# EAGLE schematic TripleClockGenerator (EAGLE 9.5.2)
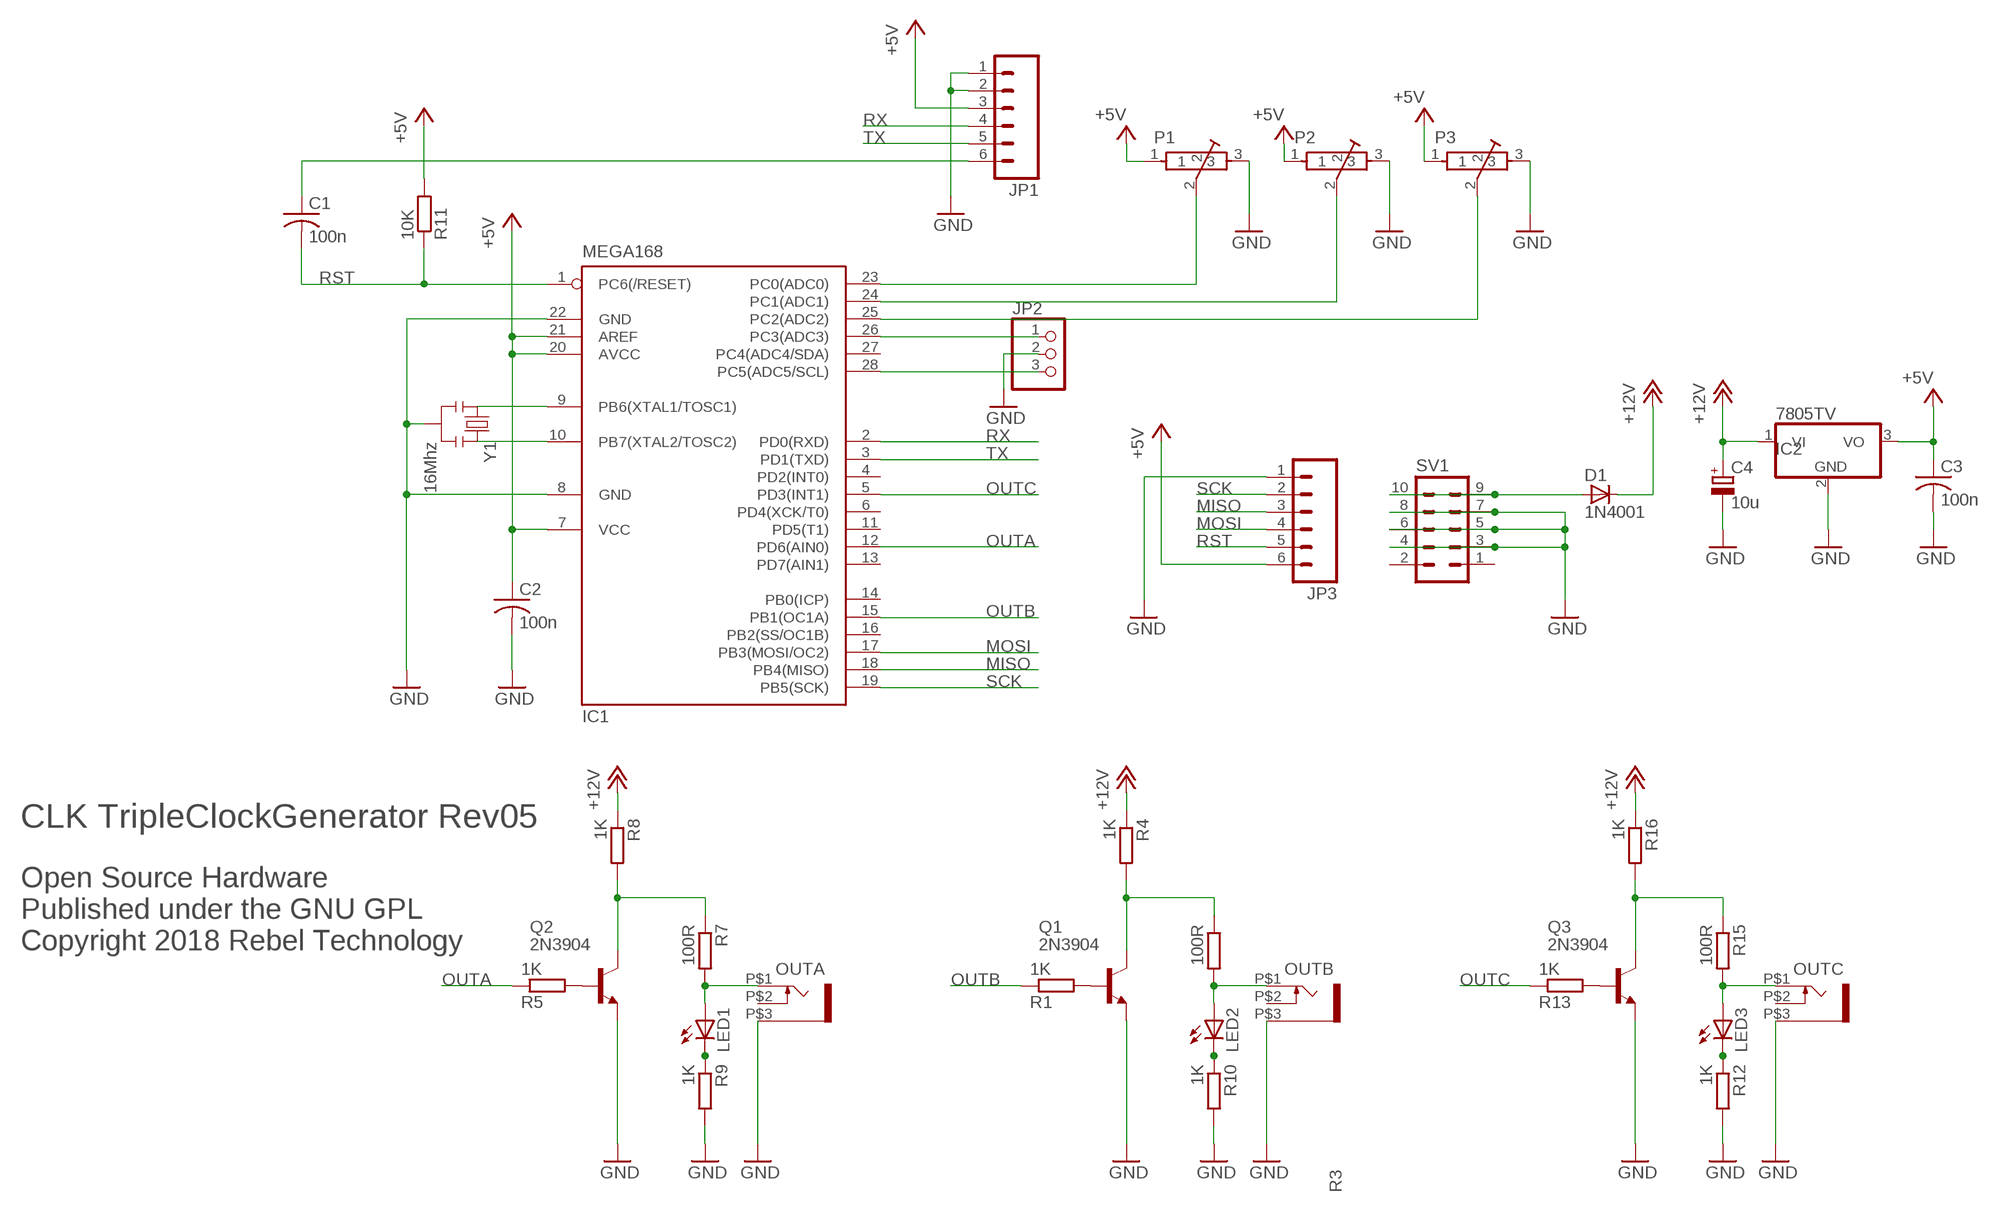
[diagram p0: schematic, sheet 1]

## Parts
C1  100n  C-US050-024X044  [C050-024X044]
C2  100n  C-US050-024X044  [C050-024X044]
C3  100n  C-US050-024X044  [C050-024X044]
C4  10u  CPOL-EUE5-6  [E5-6]
D1  1N4001  DIODE1N4001  [DIODE-1N4001]
IC1  MEGA168  MEGA8-P  [DIL28-3]
IC2  7805TV  [TO220V]
JP1  M06SIP  [1X06]
JP2  PINHD-1X3  [1X03]
JP3  M06SIP  [1X06]
LED1  LED3MM  [LED3MM]
LED2  LED3MM  [LED3MM]
LED3  LED3MM  [LED3MM]
OUTA  JACK-UJ-3502-RSLOT  [UJ-3502-R-SLOT]
OUTB  JACK-UJ-3502-RSLOT  [UJ-3502-R-SLOT]
OUTC  JACK-UJ-3502-RSLOT  [UJ-3502-R-SLOT]
P1  POT-BOURNS-PTD901  [POT-BOURNS-PTD901]
P2  POT-BOURNS-PTD901  [POT-BOURNS-PTD901]
P3  POT-BOURNS-PTD901  [POT-BOURNS-PTD901]
Q1  2N3904  [TO92]
Q2  2N3904  [TO92]
Q3  2N3904  [TO92]
R1  1K  R-EU_0204/7  [0204/7]
R3  100R  R-EU_0204/7  [0204/7]
R4  1K  R-EU_0204/7  [0204/7]
R5  1K  R-EU_0204/7  [0204/7]
R7  100R  R-EU_0204/7  [0204/7]
R8  1K  R-EU_0204/7  [0204/7]
R9  1K  R-EU_0204/7  [0204/7]
R10  1K  R-EU_0204/7  [0204/7]
R11  10K  R-EU_0204/7  [0204/7]
R12  1K  R-EU_0204/7  [0204/7]
R13  1K  R-EU_0204/7  [0204/7]
R15  100R  R-EU_0204/7  [0204/7]
R16  1K  R-EU_0204/7  [0204/7]
SV1  MA05-2  [MA05-2]
Y1  16Mhz  RESONATORPTH  [RESONATOR-PTH]

## Nets
+5V: C2.1 C3.1 IC1.7(VCC) IC1.20(AVCC) IC1.21(AREF) IC2.3(VO) JP1.3 JP3.6 P1.1 P2.1 P3.1 R11.2
+12V: C4.+ D1.C IC2.1(VI) R4.1 R8.1 R16.1
ADC0: IC1.23(PC0(ADC0)) P1.2
ADC1: IC1.24(PC1(ADC1)) P2.2
ADC2: IC1.25(PC2(ADC2)) P3.2
GND: C2.2 C3.2 C4.- IC1.8(GND) IC1.22(GND) IC2.2(GND) JP1.1 JP1.2 JP2.2 JP3.1 OUTA.P$3(SLEEVE) OUTB.P$3(SLEEVE) OUTC.P$3(SLEEVE) P1.3 P2.3 P3.3 Q1.3(E) Q2.3(E) Q3.3(E) R9.2 R10.2 R12.2 SV1.3 SV1.4 SV1.5 SV1.6 SV1.7 SV1.8 Y1.2
MISO: IC1.18(PB4(MISO)) JP3.3
MOSI: IC1.17(PB3(MOSI/OC2)) JP3.4
N$3: LED3.K(C) R12.1
N$7: IC1.9(PB6(XTAL1/TOSC1)) Y1.1
N$8: IC1.10(PB7(XTAL2/TOSC2)) Y1.3
N$11: IC1.28(PC5(ADC5/SCL)) JP2.3
N$13: LED2.A OUTB.P$1(TIP) R3.2
N$14: Q1.1(C) R3.1 R4.2
N$15: IC1.26(PC3(ADC3)) JP2.1
N$21: Q1.2(B) R1.2
N$22: Q3.2(B) R13.2
N$23: LED3.A OUTC.P$1(TIP) R15.2
N$24: Q3.1(C) R15.1 R16.2
N$25: Q2.2(B) R5.2
N$26: LED1.A OUTA.P$1(TIP) R7.2
N$27: Q2.1(C) R7.1 R8.2
N$28: LED1.K(C) R9.1
N$29: C1.1 JP1.6
N$30: LED2.K(C) R10.1
N$45: D1.A SV1.9 SV1.10
OUTA: IC1.12(PD6(AIN0)) R5.1
OUTB: IC1.15(PB1(OC1A)) R1.1
OUTC: IC1.5(PD3(INT1)) R13.1
RST: C1.2 IC1.1(PC6(/RESET)) JP3.5 R11.1
RX: IC1.2(PD0(RXD)) JP1.4
SCK: IC1.19(PB5(SCK)) JP3.2
TX: IC1.3(PD1(TXD)) JP1.5
Unconnected: IC1.4(PD2(INT0)) IC1.6(PD4(XCK/T0)) IC1.11(PD5(T1)) IC1.13(PD7(AIN1)) IC1.14(PB0(ICP)) IC1.16(PB2(SS/OC1B)) IC1.27(PC4(ADC4/SDA)) OUTA.P$2(SW) OUTB.P$2(SW) OUTC.P$2(SW) SV1.1 SV1.2

## Notes on the sheet
- CLK TripleClockGenerator Rev05
- Open Source Hardware
  Published under the GNU GPL
  Copyright 2018 Rebel Technology

## Library data of the parts
C1-C3 = rcl:C-US: CAPACITOR, American symbol
C4 = rcl:CPOL-EU: POLARIZED CAPACITOR, European symbol
D1 = Rebel:DIODE: Diode These are standard reverse protection diodes and small signal diodes. SMA package can handle up to about 1A. SOD-323 can handle about 200mA. Watch the SOD-323 package when ordering, there are some mfgs out there that are 5-pin packages.
IC1 = atmel:MEGA8-P: MICROCONTROLLER 8 Kbytes FLASH, 1 kbytes SRAM, 512 bytes EEPROM, USART, 4-channel 10 bit ADC, 2-channel 8 bit ADC Pin compatible with Atmega48, ATMega88, ATMega168 Source: avr.lbr; OC_FARNELL: unknown; OC_NEWARK: unknown
IC2 = linear:78*: Positive VOLTAGE REGULATOR Source: http://cache.national.com/ds/LM/LM78L05.pdf http://www.fairchildsemi.com/ds/LM/LM7805.pdf
JP1 JP3 = SparkFun:M06: Header 6 Standard 6-pin 0.1" header. Use with straight break away headers (SKU : PRT-00116), right angle break away headers (PRT-00553), swiss pins (PRT-00743), machine pins (PRT-00117), and female headers (PRT-00115). Molex polarized connector foot print use with SKU : PRT-08094 with associated crimp pins and housings. NOTES ON THE VARIANTS LOCK and LOCK_LONGPADS... This footprint was designed to help hold the alignment of a through-hole component (i.e. 6-pin header) while soldering it into place. You may notice that each hole has been shifted either up or down by 0.005 of an inch from it's more standard position (which is a perfectly straight line). This slight alteration caused the pins (the squares in the middle) to touch the edges of the holes. Because they are alternating, it causes a "brace" to hold the component in place. 0.005 has proven to be the perfect amount of "off-center" position when using our standard breakaway headers. Although looks a little odd when you look at the bare footprint, once you have a header in there, the alteration is very hard to notice. Also, if you push a header all the way into place, it is covered up entirely on the bottom side. This idea of altering the position of holes to aid alignment will be further integrated into the Sparkfun Library for other footprints. It can help hold any component with 3 or more connection pins.
JP2 = pinhead:PINHD-1X3: PIN HEADER
LED1-LED3 = Rebel:LED: LED
OUTA OUTB OUTC = Rebel:JACK-UJ-3502-R
P1-P3 = Rebel:POT-BOURNS-PTD901
Q1-Q3 = transistor-npn:2N3904: NPN Transistor
R1 R3-R5 R7-R13 R15 R16 = rcl:R-EU_: RESISTOR, European symbol
SV1 = Rebel:MA05-2: PIN HEADER; OC_FARNELL: unknown; OC_NEWARK: unknown
Y1 = SparkFun:RESONATOR: Resonator Small SMD resonator. This is the itty bitty 10/20MHz resonators with built in caps. CSTCE10M0G55 and CSTCE20M0V53. Footprint has been reviewed closely but hasn't been tested yet.